# EAGLE design Bus_Isolator (EAGLE 6.5.0)
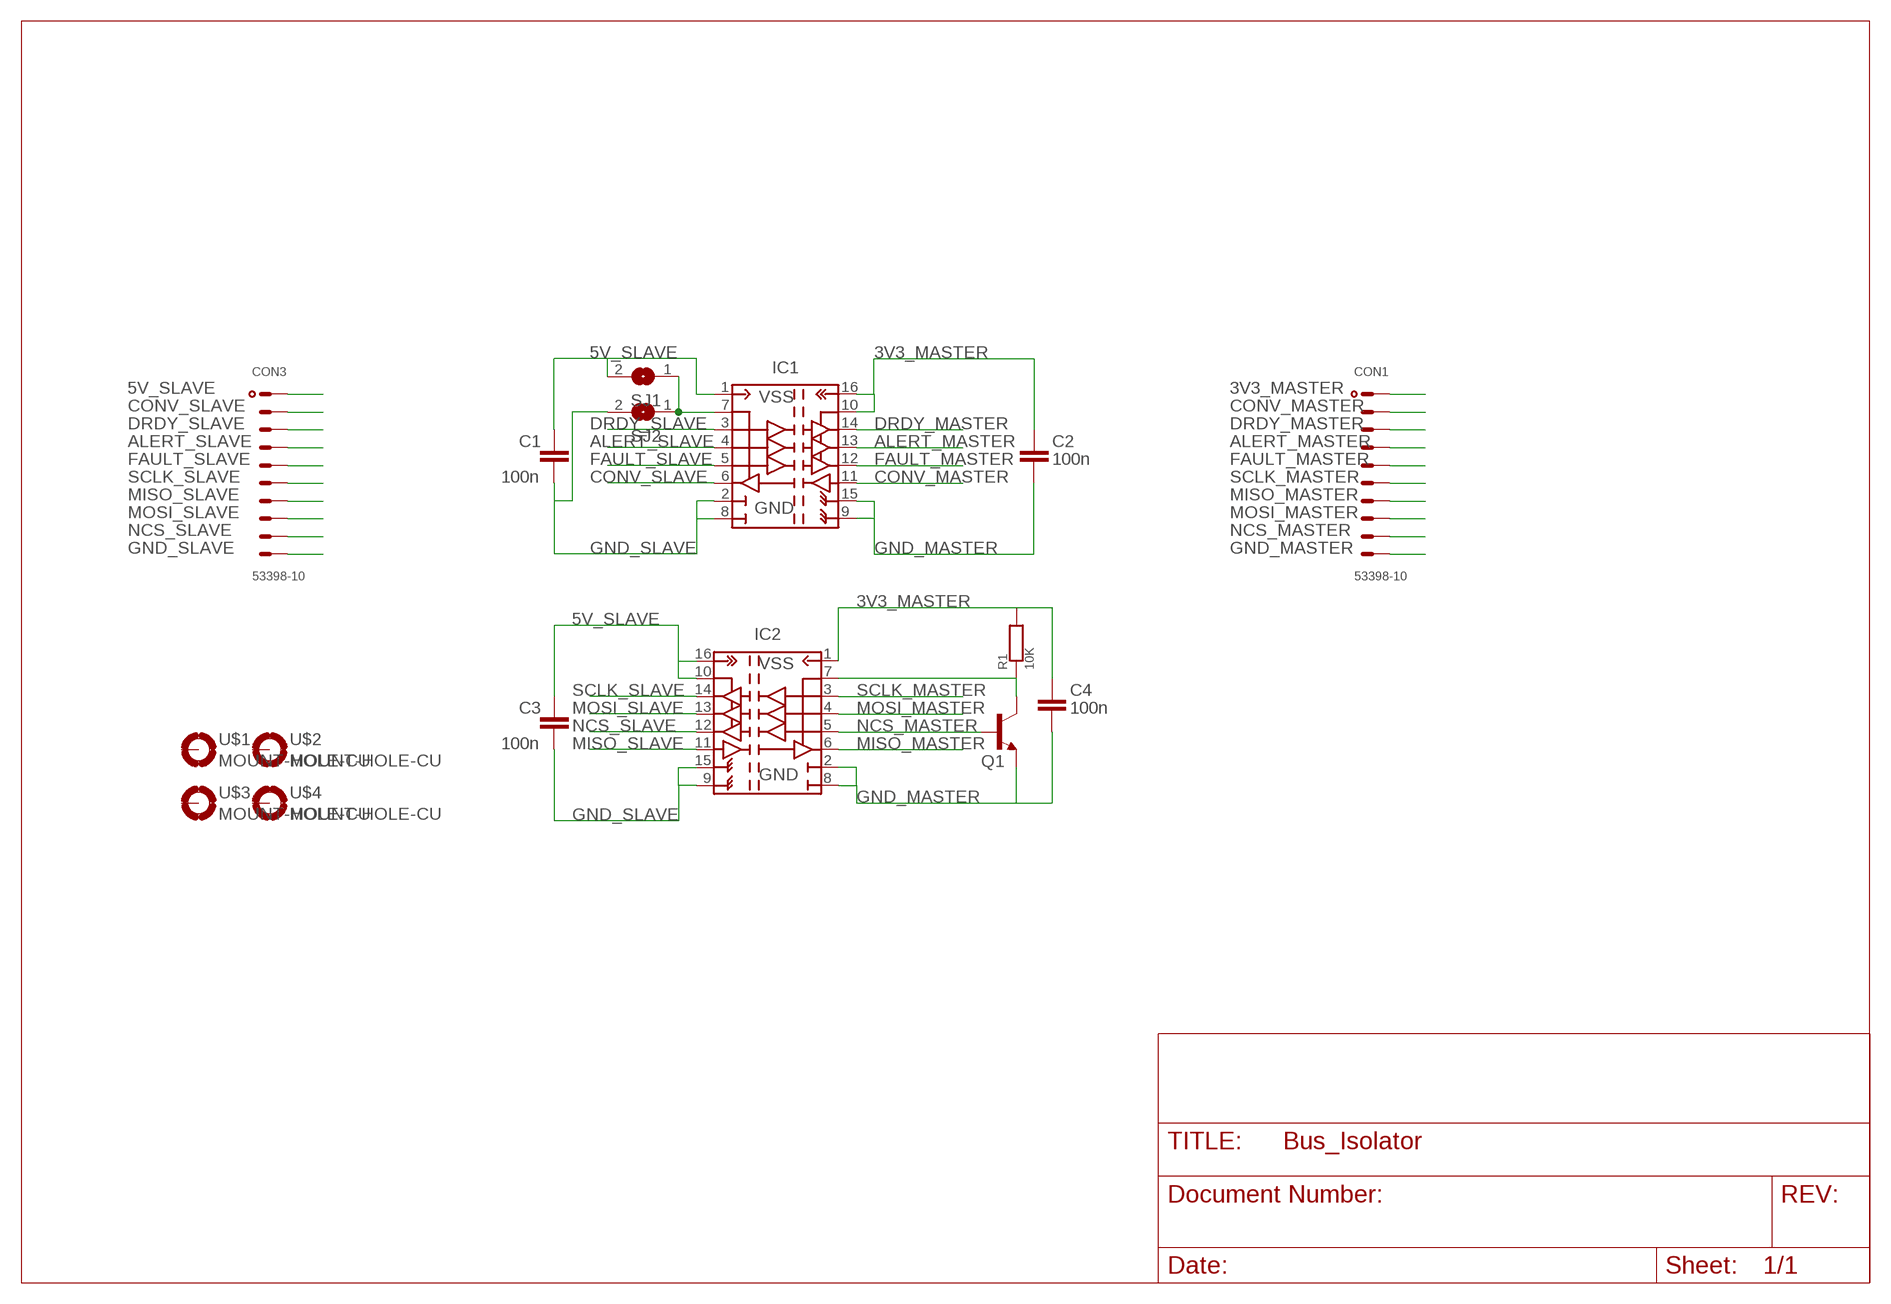
[diagram p0: schematic, sheet 1]

## Parts
C1  100n  CSTD  [C0805]
C2  100n  CSTD  [C0805]
C3  100n  CSTD  [C0805]
C4  100n  CSTD  [C0805]
CON1  53398-10  [53398-10]
CON3  53398-10  [53398-10]
IC1  ISO7241  [R-PDSO-G16]
IC2  ISO7241  [R-PDSO-G16]
Q1  TRANSISTOR_NPNSOT23  [SOT23]
R1  10K  R  [R0805]
SJ1  SJ  [SJ]
SJ2  SJ  [SJ]
U$1  MOUNT-HOLE-CU  [BOHRUNG-3,2-NUR-KUPFER]
U$2  MOUNT-HOLE-CU  [BOHRUNG-3,2-NUR-KUPFER]
U$3  MOUNT-HOLE-CU  [BOHRUNG-3,2-NUR-KUPFER]
U$4  MOUNT-HOLE-CU  [BOHRUNG-3,2-NUR-KUPFER]

## Nets
3V3_MASTER: C2.2 C4.2 CON1.1 IC1.10(EN2) IC1.16(VCC2) IC2.1(VCC1) R1.2
5V_SLAVE: C1.2 C3.2 CON3.1 IC1.1(VCC1) IC2.10(EN2) IC2.16(VCC2) SJ1.2
ALERT_MASTER: CON1.4 IC1.13(OUT_B)
ALERT_SLAVE: CON3.4 IC1.4(IN_B)
CONV_MASTER: CON1.2 IC1.11(IN_D)
CONV_SLAVE: CON3.2 IC1.6(OUT_D)
DRDY_MASTER: CON1.3 IC1.14(OUT_A)
DRDY_SLAVE: CON3.3 IC1.3(IN_A)
FAULT_MASTER: CON1.5 IC1.12(OUT_C)
FAULT_SLAVE: CON3.5 IC1.5(IN_C)
GND_MASTER: C2.1 C4.1 CON1.10 IC1.9(GND22) IC1.15(GND21) IC2.2(GND11) IC2.8(GND12) Q1.2(E)
GND_SLAVE: C1.1 C3.1 CON3.10 IC1.2(GND11) IC1.8(GND12) IC2.9(GND22) IC2.15(GND21) SJ2.2
MISO_MASTER: CON1.7 IC2.6(OUT_D)
MISO_SLAVE: CON3.7 IC2.11(IN_D)
MOSI_MASTER: CON1.8 IC2.4(IN_B)
MOSI_SLAVE: CON3.8 IC2.13(OUT_B)
N$1: IC1.7(EN1) SJ1.1 SJ2.1
N$2: IC2.7(EN1) Q1.3(C) R1.1
NCS_MASTER: CON1.9 IC2.5(IN_C) Q1.1(B)
NCS_SLAVE: CON3.9 IC2.12(OUT_C)
SCLK_MASTER: CON1.6 IC2.3(IN_A)
SCLK_SLAVE: CON3.6 IC2.14(OUT_A)
Unconnected: U$1.B3,2(MOUNT) U$2.B3,2(MOUNT) U$3.B3,2(MOUNT) U$4.B3,2(MOUNT)

## Library data of the parts
C1-C4 = useful:C
CON1 CON3 = con-molex:53?-10: CONNECTOR wire to board 1.25 mm (.049 inch) pitch header
IC1 IC2 = ti:ISO7241
Q1 = SparkFun:TRANSISTOR_NPN: Transistor NPN BJT configuration in SOT23 package. MMBT2222 is the common NPN we use. Double check BCE configuration again layout.
R1 = useful:R
SJ1 SJ2 = jumper:SJ: SMD solder JUMPER
U$1-U$4 = special:MOUNT-HOLE-CU

## Board
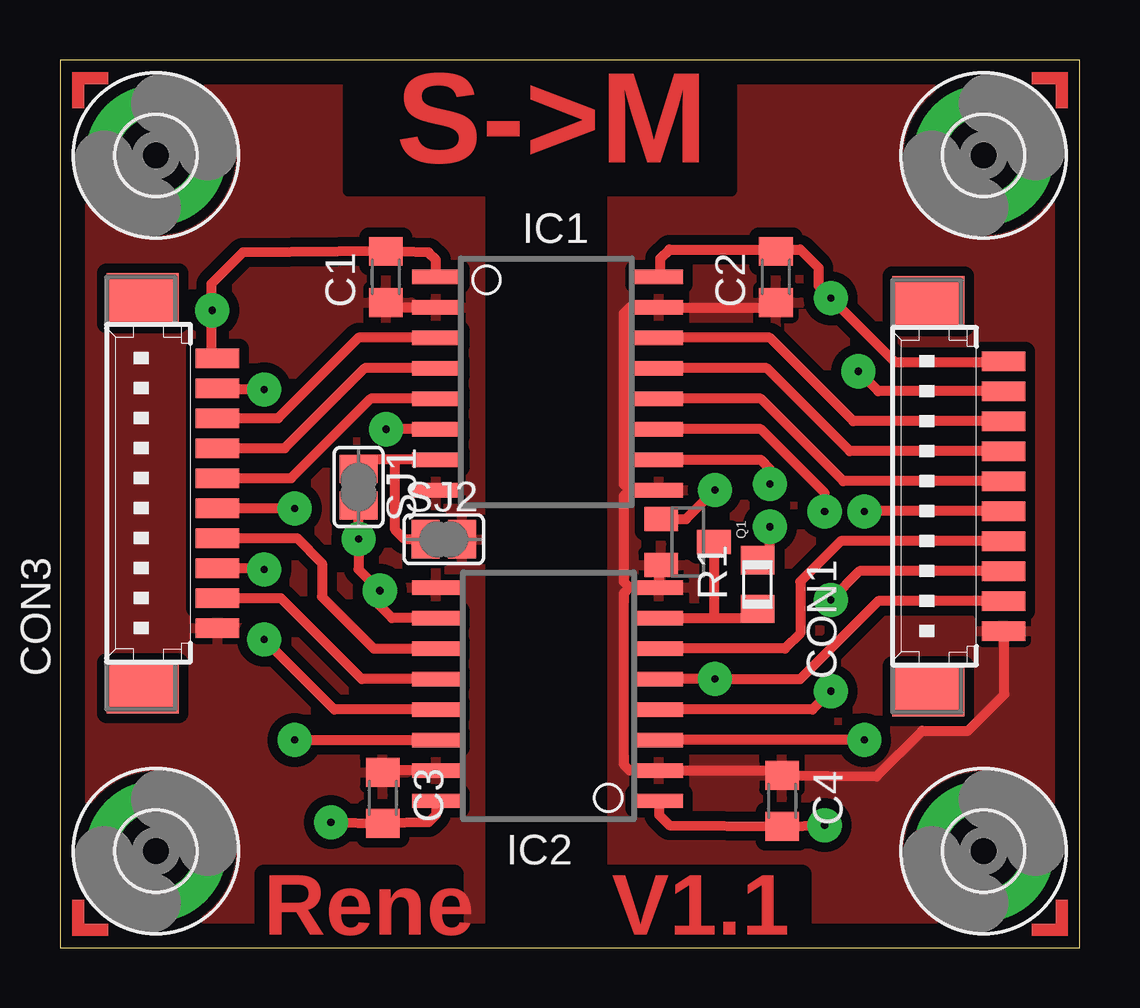
[diagram p1: board, top side]
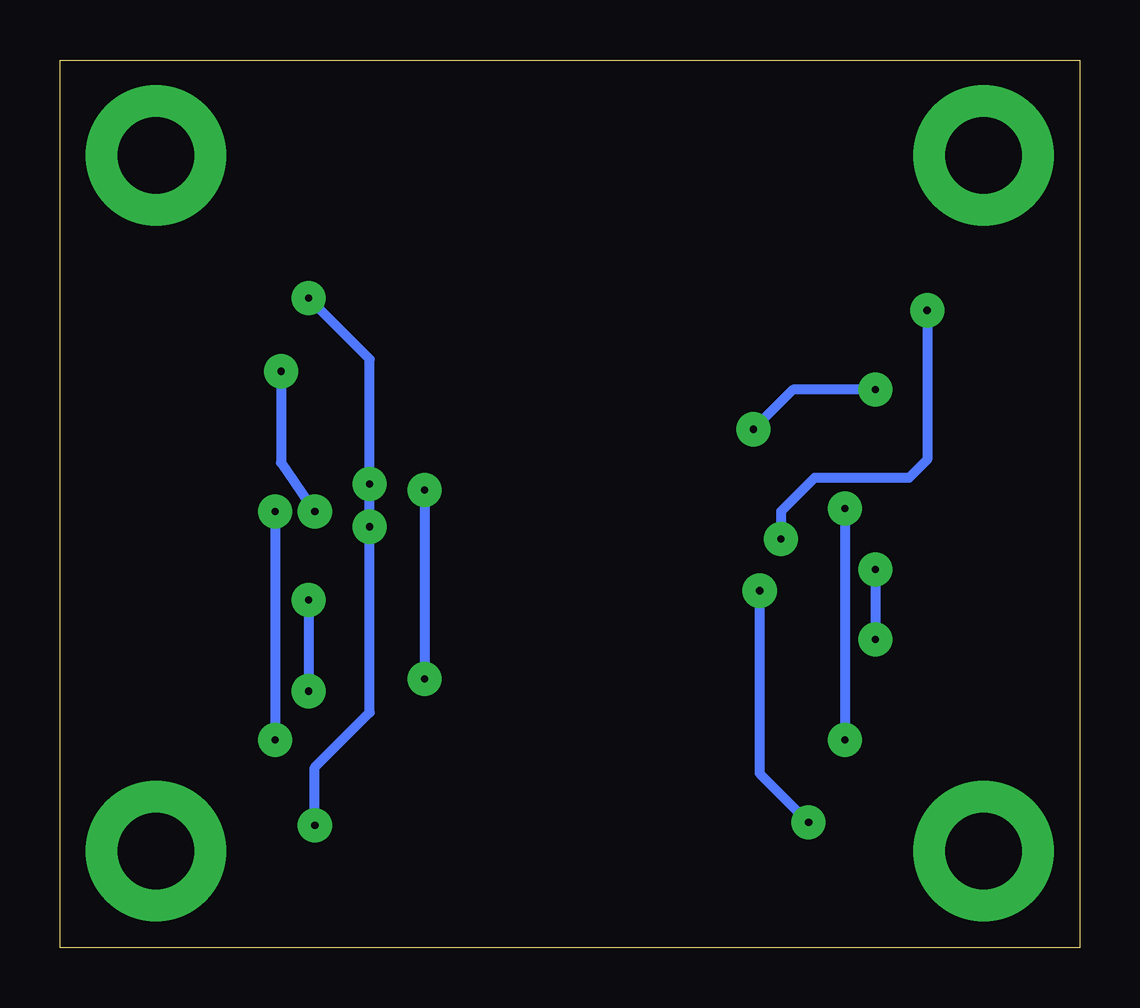
[diagram p2: board, bottom side, seen from below]

Size 42.5 x 37 mm. Coordinates in mm from the lower left corner, seen from the top.
Outline: 0,0 42.5,0 42.5,37 0,37 0,0
Copper layers (1*16): Top 0.035mm / dielectric 1.5mm / Bottom 0.035mm
Design rules "default": minimum track width 10mil, minimum drill 24mil, track to track 8mil, track to pad 8mil, pad to pad 8mil, via to via 8mil, smd to smd 8mil, copper to edge 40mil, drill to drill 8mil, minimum pad ring 10mil, minimum via ring 8mil, stop-mask expansion 4mil, vias tented up to drill 0mil, thermal gap 10mil

### Footprints (pad centres in the part's own frame; a part is rotated, then mirrored left to right if it is on the bottom)
C0805 = smd 1.2 x 1.4: 1 -1.066,0; 2 1.066,0
53398-10 = smd 0.8 x 1.8: 1 5.625,-2.5; 2 4.375,-2.5; 3 3.125,-2.5; 4 1.875,-2.5; 5 0.625,-2.5; 6 -0.625,-2.5; 7 -1.875,-2.5; 8 -3.125,-2.5; 9 -4.375,-2.5; 10 -5.625,-2.5 | smd 2.1 x 3: S1 8.125,0.625; S2 -8.125,0.625
R-PDSO-G16 = smd 0.6 x 2: 1 -3.937,-4.649; 2 -2.667,-4.649; 3 -1.397,-4.649; 4 -0.127,-4.649; 5 1.143,-4.649; 6 2.413,-4.649; 7 3.683,-4.649; 8 4.953,-4.649; 9 4.953,4.651; 10 3.683,4.651; 11 2.413,4.651; 12 1.143,4.651; 13 -0.127,4.651; 14 -1.397,4.651; 15 -2.667,4.651; 16 -3.937,4.651
SOT23 = smd 1 x 1.4: 1 -0.95,-1.1; 2 0.95,-1.1; 3 0,1.1
R0805 = smd 1.168 x 1.397: 1 -1.016,0; 2 1.016,0
SJ = smd 1.168 x 1.6: 1 -0.762,0; 2 0.762,0
BOHRUNG-3,2-NUR-KUPFER = drill 3.2 pad 5.842: B3,2 0,0

### Placement (x,y rotation side)
C1  13.59,27.96 90 top
C2  29.84,27.96 90 top
C3  13.45,6.24 270 top
C4  30.1,6.11 270 top
CON1  36.83,18.81 90 top
CON3  4.06,18.94 90 top
IC1  20.32,24.02 270 top
IC2  20.32,10.05 90 top
Q1  26.16,16.91 270 top
R1  29.08,15.13 90 top
SJ1  12.45,19.19 270 top
SJ2  16,17.02 0 top
U$1  4,4.02 0 top
U$2  4,33.02 0 top
U$3  38.5,33.02 0 top
U$4  38.5,4.02 0 top

### Tracks (layer width: path | path; a pad name or v marks a point on that pad's centre or on a via)
3V3_MASTER  (via drill 0.3 pad 1.42)
  Top 0.406: 30.23,29.1 25.4,29.1 25.02,28.72 25.02,28 IC1.16 | 30.23,29.1 C2.2 | 30.23,29.1 30.86,29.1 31.62,28.34 31.62,27.58 v32.13,27.07 34.8,24.4 38.66,24.4 CON1.1 | IC1.10 29.21,20.34 29.59,19.96 v29.59,19.32 | IC2.1 24.97,5.53 25.4,5.1 C4.2 v31.88,5.1 | R1.2 29.59,16.15 v29.59,17.54
  Bottom 0.406: v32.13,27.07 29.59,24.53 v29.59,19.32 v29.59,17.54 29.59,9.8 31.88,7.51 v31.88,5.1
5V_SLAVE  (via drill 0.3 pad 1.42)
  Top 0.406: 12.7,18.43 SJ1.2 12.45,18.3 12.45,18.18 v12.45,17.04 12.45,15.76 v13.34,14.88 13.34,14.24 13.84,13.73 IC2.10 | v11.29,5.22 C3.2 15.37,5.22 15.67,5.53 IC2.16 | IC1.1 15.67,28.67 15.37,28.97 C1.2 7.62,28.97 6.31,27.66 6.31,26.6 v6.35,26.56 6.31,26.52 6.31,24.82 CON3.1
  Bottom 0.406: v6.35,26.56 6.35,20.34 7.11,19.57 11.05,19.57 12.45,18.18 v12.45,17.04 | v13.34,14.88 13.34,7.26 v11.29,5.22
ALERT_MASTER
  Top 0.406: CON1.4 32.92,20.69 29.46,24.15 IC1.13
ALERT_SLAVE
  Top 0.406: CON3.4 9.37,20.81 12.7,24.15 IC1.4
CONV_MASTER  (via drill 0.3 pad 1.42)
  Top 0.406: CON1.2 34.11,23.19 v33.28,24.02 | v31.88,18.18 31.88,18.94 29.21,21.61 IC1.11
  Bottom 0.406: v33.28,24.02 33.28,20.22 v31.88,18.18
CONV_SLAVE  (via drill 0.3 pad 1.42)
  Top 0.406: v8.51,23.26 6.37,23.26 CON3.2 | IC1.6 v13.59,21.61
  Bottom 0.406: v8.51,23.26 11.94,23.26 v13.59,21.61
DRDY_MASTER
  Top 0.406: CON1.3 33.07,21.94 29.59,25.42 IC1.14
DRDY_SLAVE
  Top 0.406: CON3.3 9.09,22.06 12.45,25.42 IC1.3
FAULT_MASTER
  Top 0.406: CON1.5 32.65,19.44 29.21,22.88 IC1.12
FAULT_SLAVE
  Top 0.406: CON3.5 9.64,19.56 12.95,22.88 IC1.5
GND_MASTER
  Top 0.406: C2.1 29.59,26.69 IC1.15 23.75,26.69 23.5,26.43 23.5,19.32 23.75,19.07 | IC1.9 23.75,19.07 | 23.75,19.07 23.5,18.81 23.5,15.26 23.75,15 | 23.75,15 IC2.8 24.97,15.96 Q1.2 | 23.75,15 23.5,14.75 23.5,7.64 23.75,7.38 IC2.2 29.84,7.38 C4.1 34.04,7.13 35.94,9.03 37.85,9.03 39.37,10.56 39.37,13.15 CON1.10
  pour Top (isolate 0.406): 23,37.52 23,-0.48 37.5,-0.48 42.5,4.52 42.5,32.52 37.5,37.52
  cutout Top: 21.5,38.52 28,38.52 28,31.52 21.5,31.52
GND_SLAVE
  Top 0.406: IC1.2 13.84,26.69 C1.1 | IC2.15 13.58,7.38 C3.1
  pour Top (isolate 0.406): 4,37 17.5,37 17.5,-0.5 4.5,-0.5 -0.5,4 -0.5,32.5
  cutout Top: 12,38.02 18.5,38.02 18.5,31.52 12,31.52
MISO_MASTER
  Top 0.406: CON1.7 32.54,16.94 30.86,15.26 30.86,13.1 30.23,12.46 IC2.6
MISO_SLAVE
  Top 0.406: IC2.11 13.08,12.46 10.92,14.62 10.92,16.02 9.88,17.06 CON3.7
MOSI_MASTER  (via drill 0.3 pad 1.42)
  Top 0.406: CON1.8 33.32,15.69 v32.13,14.49 | v32.13,10.68 31.37,9.92 IC2.4
  Bottom 0.406: v32.13,14.49 v32.13,10.68
MOSI_SLAVE  (via drill 0.3 pad 1.42)
  Top 0.406: CON3.8 8.46,15.81 v8.51,15.76 | IC2.13 11.43,9.92 v8.51,12.84
  Bottom 0.406: v8.51,15.76 v8.51,12.84
N$1
  Top 0.406: IC1.7 13.84,20.34 | 13.84,20.34 12.45,20.34 SJ1.1 | SJ2.1 14.37,17.02 13.97,17.42 13.97,20.21 13.84,20.34
N$2
  Top 0.406: IC2.7 27.3,13.73 | 27.3,13.73 28.7,13.73 R1.1 | Q1.3 27.26,13.78 27.3,13.73
NCS_MASTER  (via drill 0.3 pad 1.42)
  Top 0.406: 39.39,14.49 CON1.9 34.11,14.44 30.86,11.19 v27.3,11.19 IC2.5 | Q1.1 26.1,17.86 v27.3,19.07
  Bottom 0.406: v27.3,19.07 v27.3,11.19
NCS_SLAVE
  Top 0.406: IC2.12 12.57,11.19 9.2,14.56 CON3.9
SCLK_MASTER  (via drill 0.3 pad 1.42)
  Top 0.406: CON1.6 v33.54,18.19 v33.53,18.18 | v33.53,8.65 IC2.3
  Bottom 0.406: v33.53,18.18 v33.53,8.65
SCLK_SLAVE  (via drill 0.3 pad 1.42)
  Top 0.406: CON3.6 9.52,18.31 v9.78,18.3 | v9.78,8.65 IC2.14
  Bottom 0.406: v9.78,18.3 v9.78,8.65
(copper drawn outside any net)
  shapes: Top area x8

### Text on the board
Top: S->M | Rene | V1.1